# Altium project BaseCricuit.PrjPcb
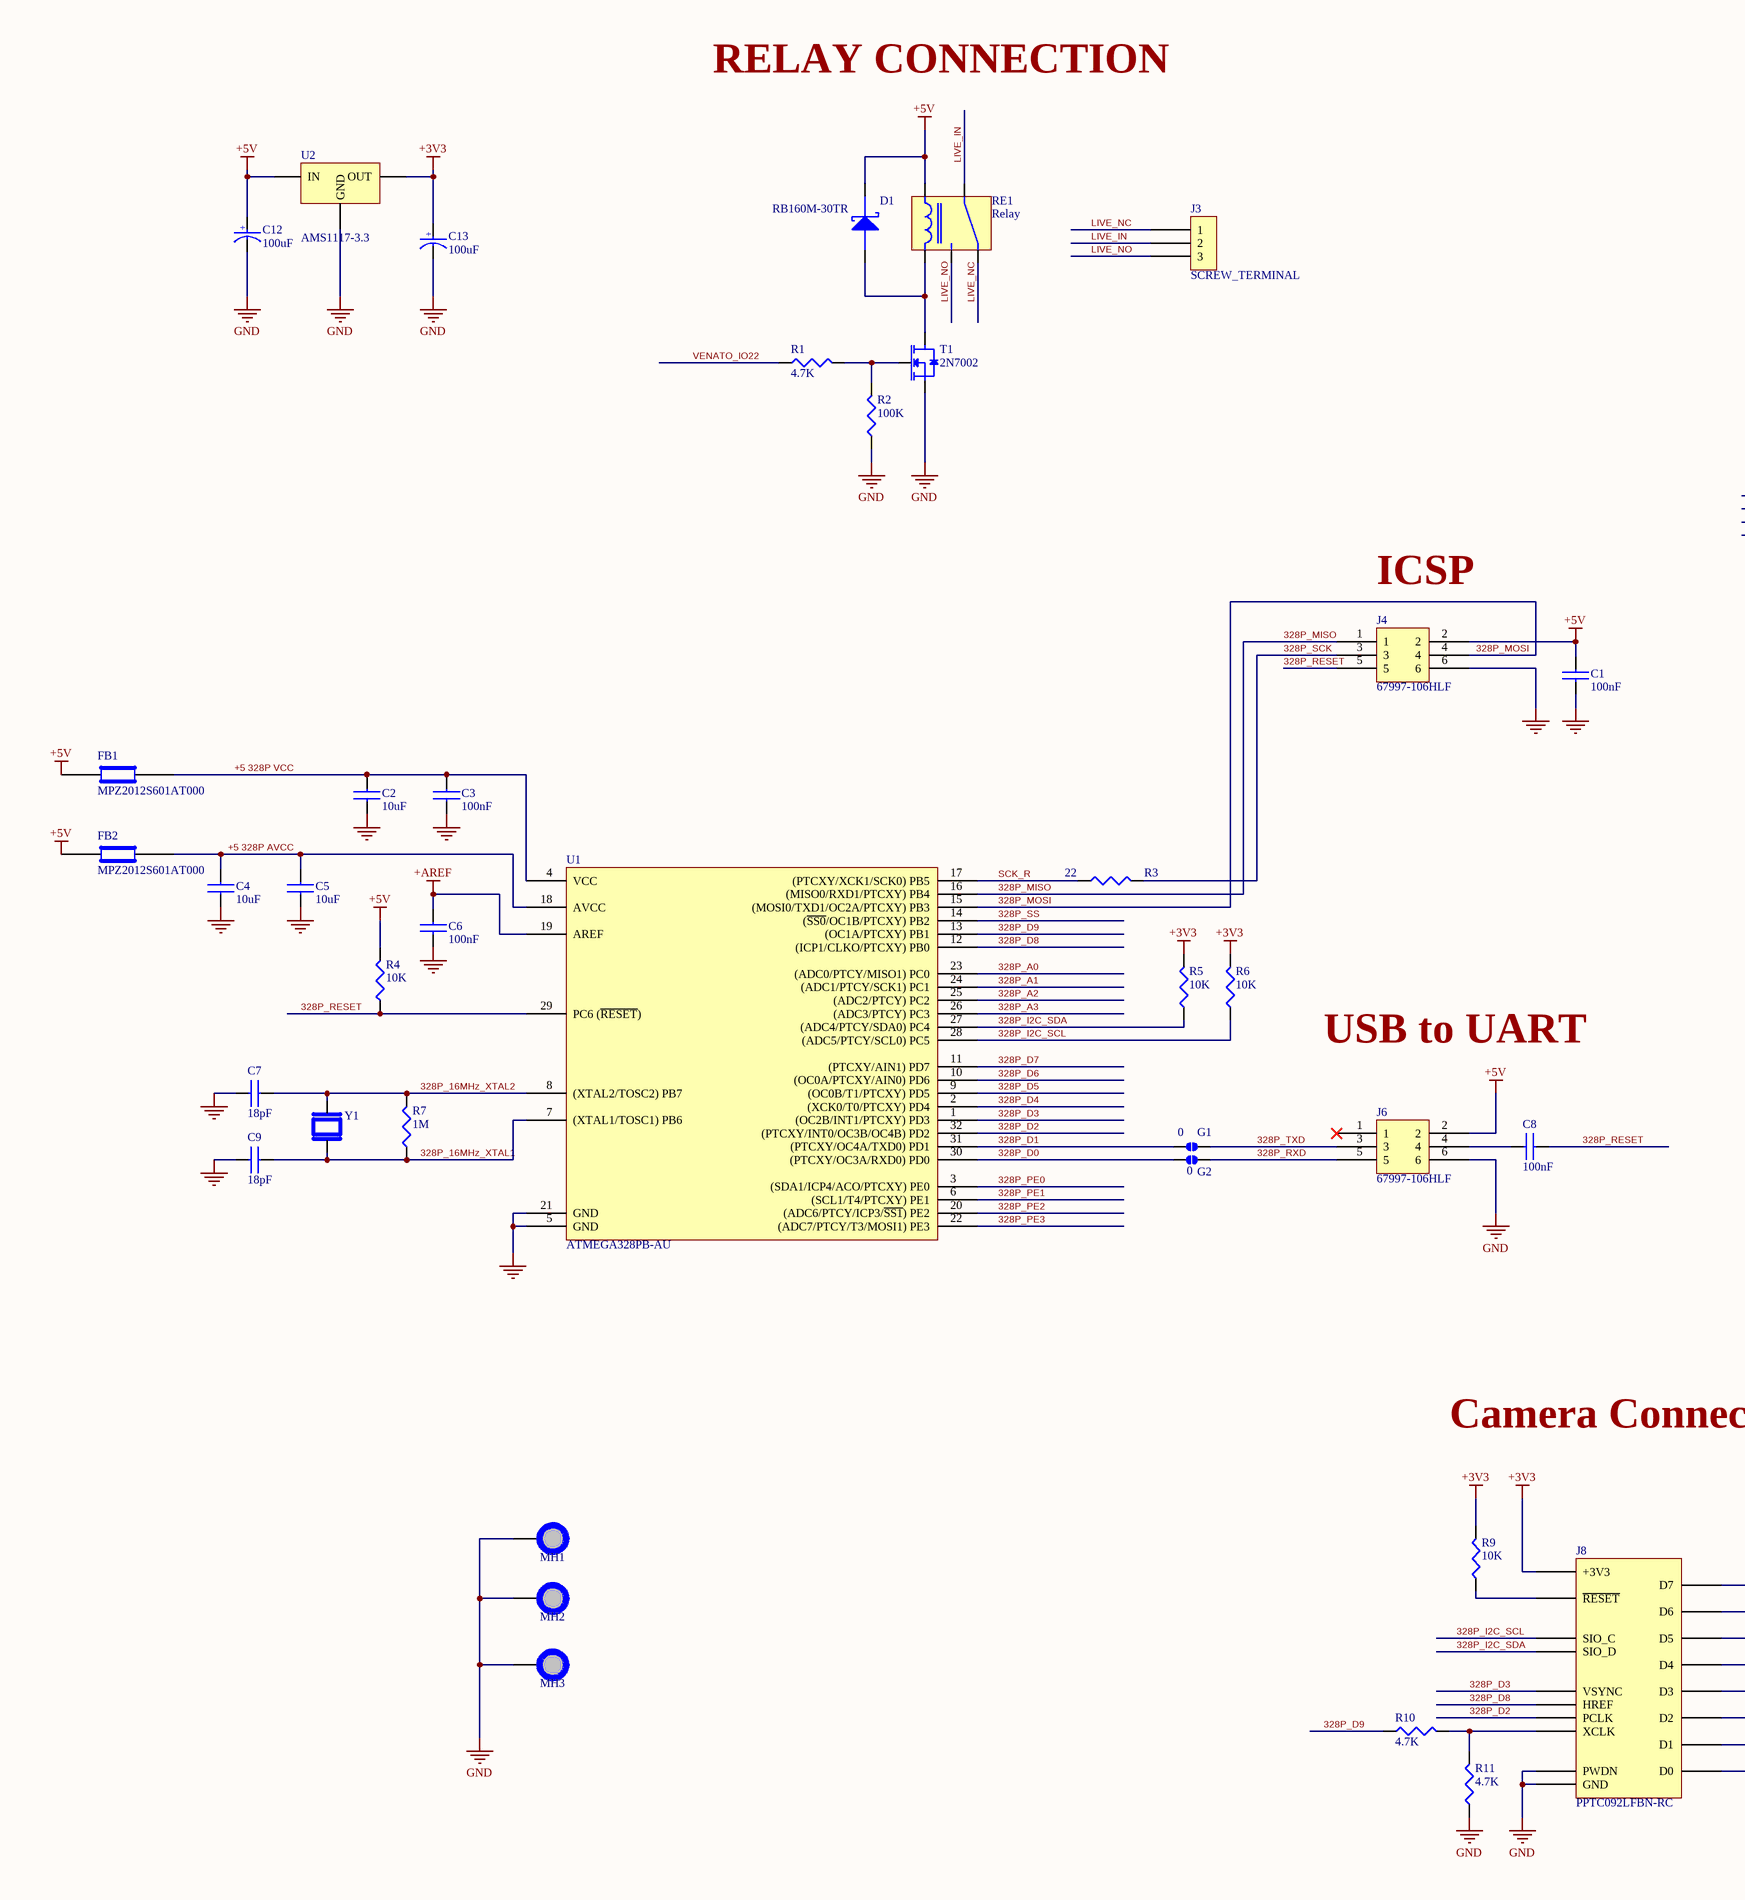
[diagram p0: BaseCircuit.SchDoc, left]
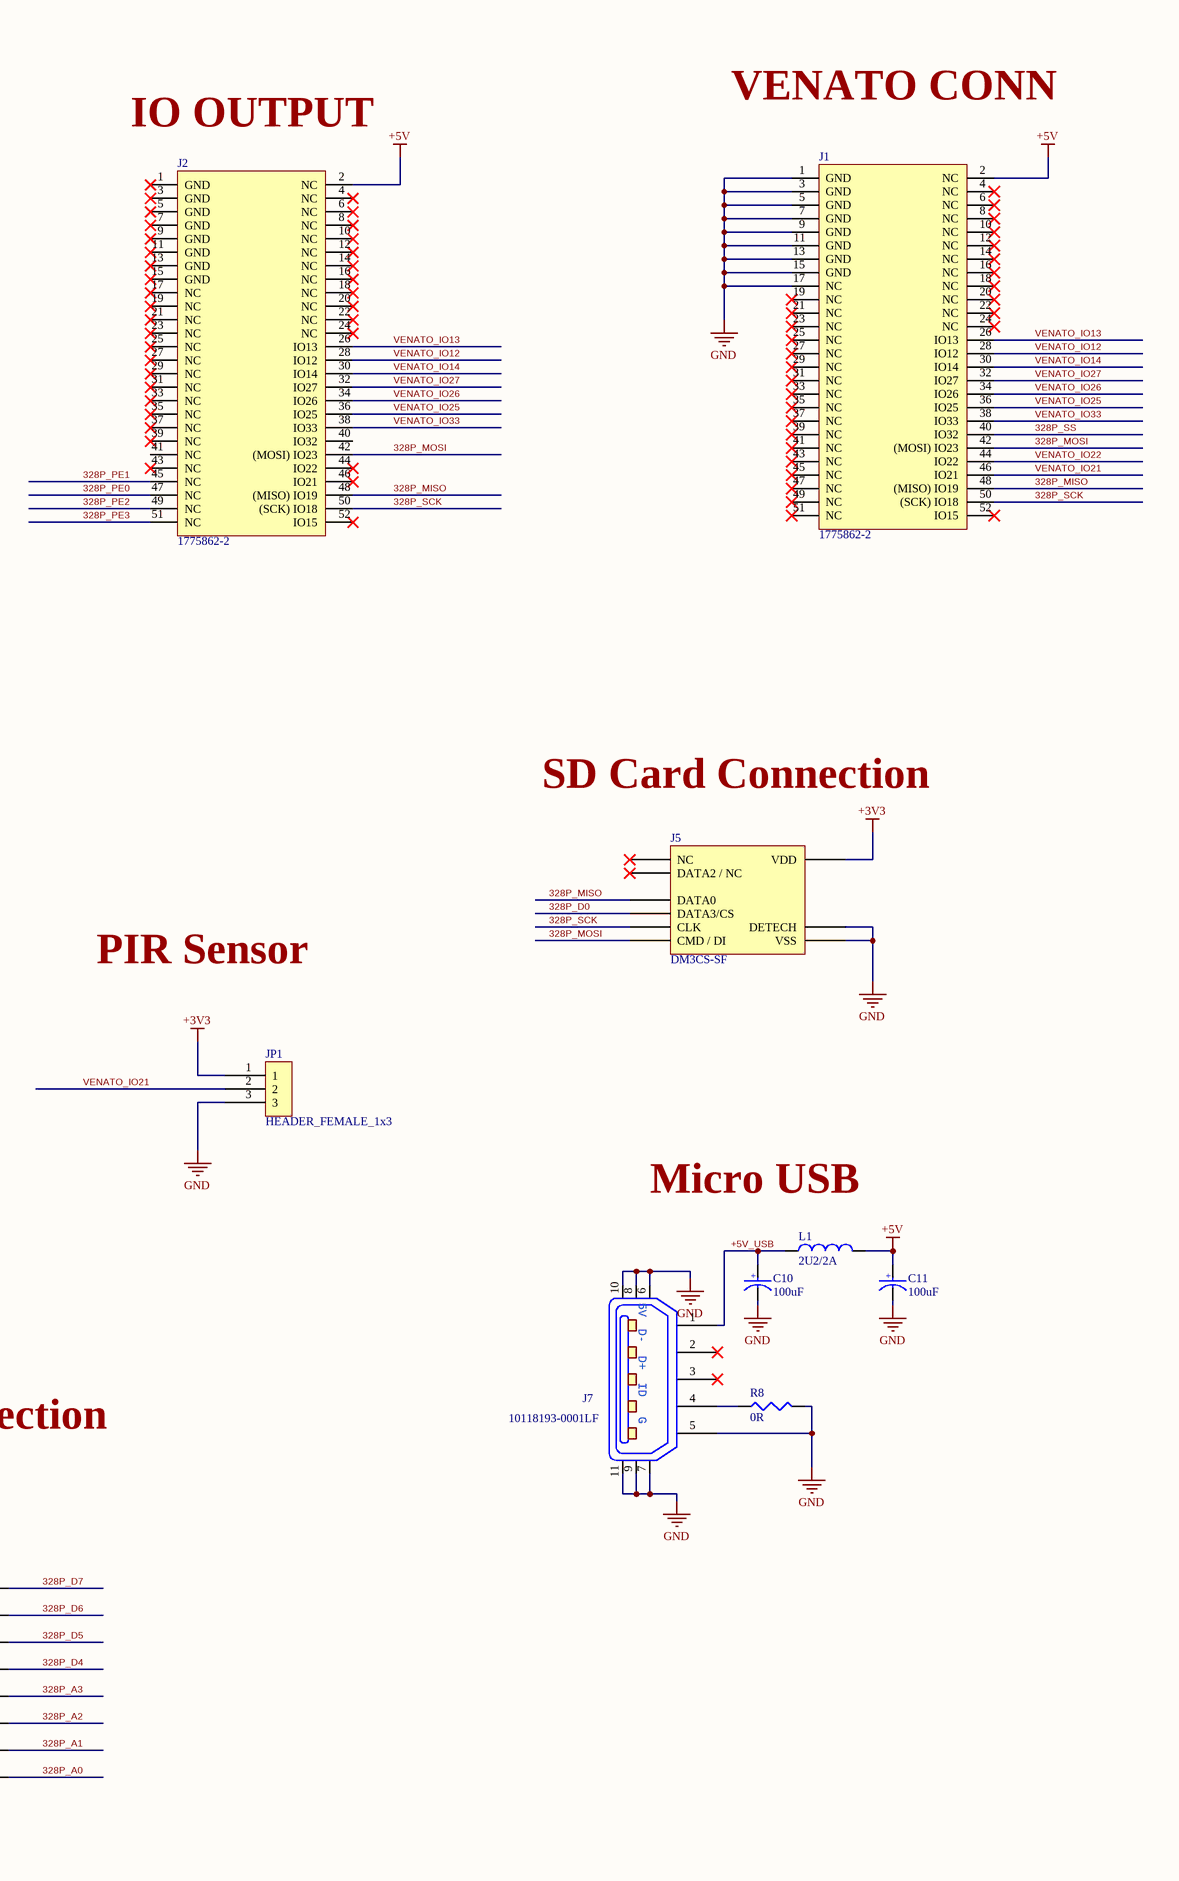
[diagram p1: BaseCircuit.SchDoc, right]
1 sheet, 47 parts. Net scope: global (net labels, ports and power ports of the same name join across sheets).
Board file: BaseCircuit.PcbDoc

## Sheet BaseCircuit.SchDoc
size 594 x 419 mm; SheetNumber: 1; SheetTotal: 1

### Parts
C1  100nF  [C0805]
C2  10uF  [C0805]
C3  100nF  [C0805]
C4  10uF  [C0805]
C5  10uF  [C0805]
C6  100nF  [C0805]
C7  18pF  [C0805]
C8  100nF  [C0805]
C9  18pF  [C0805]
C10  100uF  [C_ALU_C_SIZE]
C11  100uF  [C_ALU_C_SIZE]
C12  100uF  [C_ALU_C_SIZE]
C13  100uF  [C_ALU_C_SIZE]
D1  RB160M-30TR  [SOD123]
FB1  MPZ2012S601AT000  [C0805]
FB2  MPZ2012S601AT000  [C0805]
G1  0  [R0805_no_3d]
G2  0  [R0805_no_3d]
J1  1775862-2  [TE_1775862-2]
J2  1775862-2  [TE_1775862-2]
J3  SCREW_TERMINAL  [SCREW_TERMINAL_3_5.08MM]
J4  67997-106HLF  [HDR_2x3_2.54MM]
J5  DM3CS-SF  [GCT_MEM2051-00-195-00-A]
J6  67997-106HLF  [HDR_2x3_2.54MM]
J7  10118193-0001LF  [10118193-0001LF]
J8  PPTC092LFBN-RC  [HDR_2X9_2.54MM]
JP1  HEADER_FEMALE_1x3  [HDR_1x3_2.54MM]
L1  2U2/2A  [CL_inductor]
MH1  Mounting_hole_17.4_3.2  [MH_17.4_3.2]  (value not drawn)  (no BOM)
MH2  Mounting_hole_17.4_3.2  [MH_17.4_3.2]  (value not drawn)  (no BOM)
MH3  Mounting_hole_17.4_3.2  [MH_17.4_3.2]  (value not drawn)  (no BOM)
R1  4.7K  [R0805]
R2  100K  [R0805]
R3  22  [R0805]
R4  10K  [R0805]
R5  10K  [R0805]
R6  10K  [R0805]
R7  1M  [R0805]
R8  0R  [R0805]
R9  10K  [R0805]
R10  4.7K  [R0805]
R11  4.7K  [R0805]
RE1  Relay  [RELAY_5PIN]
T1  2N7002  [TRANS_MMBT2907A]
U1  ATMEGA328PB-AU  [TQFP_32]
U2  AMS1117-3.3  [SOT-223]
Y1  ABLS-16.000MHZ-B4-T  [XTAL_ABLS-16.000MHZ-B4-T]  (value not drawn)

### Nets
+3V3: C13.1 J5.4(VDD) J8.1(+3V3) JP1.1 R5.2 R6.2 R9.2 U2.2(OUT)
+5V: C1.2 C11.1 C12.1 D1.1(Ca) FB1.1 FB2.1 J1.2(NC) J2.2(NC) J4.2 J6.2 L1.2 R4.2 RE1.1 U2.3(IN)
+AREF: C6.2 U1.19(AREF)
GND: C1.1 C2.1 C3.1 C4.1 C5.1 C6.1 C7.1 C9.1 C10.2 C11.2 C12.2 C13.2 J1.1(GND) J1.3(GND) J1.5(GND) J1.7(GND) J1.9(GND) J1.11(GND) J1.13(GND) J1.15(GND) J1.17(NC) J4.6 J5.6(VSS) J5.9(DETECH) J6.6 J7.5 J7.6 J7.7 J7.8 J7.9 J7.10 J7.11 J8.2(GND) J8.18(PWDN) JP1.3 MH1.1 MH2.1 MH3.1 R2.1 R8.2 R11.1 T1.1 U1.5(GND) U1.21(GND) U2.1(GND)
328P_16MHz_XTAL1: C9.2 R7.1 U1.7((XTAL1/TOSC1)_PB6) Y1.1
328P_16MHz_XTAL2: C7.2 R7.2 U1.8((XTAL2/TOSC2)_PB7) Y1.2
328P_A0: J8.16(D0) U1.23((ADC0/PTCY/MISO1)_PC0)
328P_A1: J8.15(D1) U1.24((ADC1/PTCY/SCK1)_PC1)
328P_A2: J8.14(D2) U1.25((ADC2/PTCY)_PC2)
328P_A3: J8.13(D3) U1.26((ADC3/PTCY)_PC3)
328P_D0: G2.2 J5.2(DATA3/CS) U1.30((PTCXY/OC3A/RXD0)_PD0)
328P_D1: G1.2 U1.31((PTCXY/OC4A/TXD0)_PD1)
328P_D2: J8.7(PCLK) U1.32((PTCXY/INT0/OC3B/OC4B)_PD2)
328P_D3: J8.5(VSYNC) U1.1((OC2B/INT1/PTCXY)_PD3)
328P_D4: J8.12(D4) U1.2((XCK0/T0/PTCXY)_PD4)
328P_D5: J8.11(D5) U1.9((OC0B/T1/PTCXY)_PD5)
328P_D6: J8.10(D6) U1.10((OC0A/PTCXY/AIN0)_PD6)
328P_D7: J8.9(D7) U1.11((PTCXY/AIN1)_PD7)
328P_D8: J8.6(HREF) U1.12((ICP1/CLKO/PTCXY)_PB0)
328P_D9: R10.1 U1.13((OC1A/PTCXY)_PB1)
328P_I2C_SCL: J8.3(SIO_C) R6.1 U1.28((ADC5/PTCY/SCL0)_PC5)
328P_I2C_SDA: J8.4(SIO_D) R5.1 U1.27((ADC4/PTCY/SDA0)_PC4)
328P_MISO: J1.48((MISO)_IO19) J2.48((MISO)_IO19) J4.1 J5.7(DATA0) U1.16((MISO0/RXD1/PTCXY)_PB4)
328P_MOSI: J1.42((MOSI)_IO23) J2.42((MOSI)_IO23) J4.4 J5.3(CMD_/_DI) U1.15((MOSI0/TXD1/OC2A/PTCXY)_PB3)
328P_PE0: J2.47(NC) U1.3((SDA1/ICP4/ACO/PTCXY)_PE0)
328P_PE1: J2.45(NC) U1.6((SCL1/T4/PTCXY)_PE1)
328P_PE2: J2.49(NC) U1.20((ADC6/PTCY/ICP3/~{SS1})_PE2)
328P_PE3: J2.51(NC) U1.22((ADC7/PTCY/T3/MOSI1)_PE3)
328P_RESET: C8.1 J4.5 R4.1 U1.29(PC6_(~{RESET}))
328P_RXD: G2.1 J6.5
328P_SCK: J1.50((SCK)_IO18) J2.50((SCK)_IO18) J4.3 J5.5(CLK) R3.2
328P_SS: J1.40(IO32) U1.14((~{SS0}/OC1B/PTCXY)_PB2)
328P_TXD: G1.1 J6.3
+5 328P AVCC: C4.2 C5.2 FB2.2 U1.18(AVCC)
+5 328P VCC: C2.2 C3.2 FB1.2 U1.4(VCC)
+5V_USB: C10.1 J7.1 L1.1
LIVE_IN: J3.2 RE1.5
LIVE_NC: J3.1 RE1.3
LIVE_NO: J3.3 RE1.4
SCK_R: R3.1 U1.17((PTCXY/XCK1/SCK0)_PB5)
VENATO_IO12: J1.28(IO12) J2.28(IO12)
VENATO_IO13: J1.26(IO13) J2.26(IO13)
VENATO_IO14: J1.30(IO14) J2.30(IO14)
VENATO_IO21: J1.46(IO21) JP1.2
VENATO_IO22: J1.44(IO22) R1.1
VENATO_IO25: J1.36(IO25) J2.36(IO25)
VENATO_IO26: J1.34(IO26) J2.34(IO26)
VENATO_IO27: J1.32(IO27) J2.32(IO27)
VENATO_IO33: J1.38(IO33) J2.38(IO33)
NetC8_2: C8.2 J6.4
NetD1_2: D1.2(An) RE1.2 T1.2
NetJ7_4: J7.4 R8.1
NetJ8_8: J8.8(XCLK) R10.2 R11.2
NetJ8_17: J8.17(~{RESET}) R9.1
NetR1_2: R1.2 R2.2 T1.3

Not connected (* = marked no-connect by the designer): J1 4(NC)* 6(NC)* 8(NC)* 10(NC)* 12(NC)* 14(NC)* 16(NC)* 18(NC)* 19(NC)* 20(NC)* 21(NC)* 22(NC)* 23(NC)* 24(NC)* 25(NC)* 27(NC)* 29(NC)* 31(NC)* 33(NC)* 35(NC)* 37(NC)* 39(NC)* 41(NC)* 43(NC)* 45(NC)* 47(NC)* 49(NC)* 51(NC)* 52(IO15)*; J2 1(GND)* 3(GND)* 4(NC)* 5(GND)* 6(NC)* 7(GND)* 8(NC)* 9(GND)* 10(NC)* 11(GND)* 12(NC)* 13(GND)* 14(NC)* 15(GND)* 16(NC)* 17(NC)* 18(NC)* 19(NC)* 20(NC)* 21(NC)* 22(NC)* 23(NC)* 24(NC)* 25(NC)* 27(NC)* 29(NC)* 31(NC)* 33(NC)* 35(NC)* 37(NC)* 39(NC)* 40(IO32) 41(NC) 43(NC)* 44(IO22)* 46(IO21)* 52(IO15)*; J5 1(DATA2_/_NC)* 8(NC)*; J6 1*; J7 2* 3*

### Notes on the sheet
- RELAY CONNECTION
- VENATO CONN
- (near J2) IO OUTPUT
- (near J4) ICSP
- SD Card Connection
- PIR Sensor
- USB to UART
- Micro USB
- Camera Connection
- (in symbol 10118193-0001LF) 5V; D-; D+; ID; G
- (in symbol EEE-1AA101WR) +

### Library data of the parts
C1 C3 C6 C8 = CGA4J2X7R1H104K125AM: Cap Ceramic 0.1uF 50V X7R 10% Pad SMD 0805 125°C Automotive T/R; Manufacturer: TDK; Supplier 1: Digi-Key; Manufacturer Part Number: CGA4J2X7R1H104K125AM; RoHS: Yes; Category: Ceramic Capacitors; Stock 1: 4940; Pricing 1: 1=0.20000, 10=0.14200, 50=0.08080, 100=0.06700, 500=0.04696, 1000=0.03888 (USD); Mount: Surface Mount; Case/Package: 0805; Case Code (Metric): 2012; Case Code (Imperial): 0805; Weight: 0.000194oz; Min Operating Temperature: -55°C; Max Operating Temperature: 125°C; Capacitance: 100nF; Voltage Rating: 50V; Tolerance: 10%; Packaging: Tape and Reel; Termination: SMD/SMT; Series: CGA; Package Quantity: 1; Voltage Rating (DC): 50V; Dielectric: X7R; Resistor Type: Ceramic; Features: Soft Termination; Length: 0.079inch; Width: 0.049inch; Height: 1.25mm; Thickness: 0.057inch; Depth: 1.25mm; Ratings: AEC-Q200; RoHS Compliant: Yes; ComponentLink1URL: http://components.arrow.com/part/dataview/0323_06888403?src-supplier=Arrow+Europe; ComponentLink1Description: http://components.arrow.com/part/dataview/0323_06888403?src-supplier=Arrow+Europe; ComponentLink2URL: https://product.tdk.com/info/en/catalog/datasheets/mlcc_automotive_openmode_en.pdf?src-supplier=Digi-Key; ComponentLink2Description: https://product.tdk.com/info/en/catalog/datasheets/mlcc_automotive_openmode_en.pdf?src-supplier=Digi-Key; ComponentLink3URL: https://product.tdk.com/info/en/documents/chara_sheet/CGA4J2X7R1H104K125AM.pdf?src-supplier=Digi-Key; ComponentLink3Description: https://product.tdk.com/info/en/documents/chara_sheet/CGA4J2X7R1H104K125AM.pdf?src-supplier=Digi-Key; ComponentLink4URL: http://components.arrow.com/part/dataview/57437351S460182N1165?src-supplier=Arrow+Electronics; ComponentLink4Description: http://components.arrow.com/part/dataview/57437351S460182N1165?src-supplier=Arrow+Electronics; Supplier Part Number 1: 445-6958-1-ND
C2 C4 C5 = CGA4J3X7S1A106M125AB: Cap Ceramic 10uF 10V X7S 20% Pad SMD 0805 125°C Low ESR Automotive T/R; Manufacturer: TDK; Supplier 1: Digi-Key; Manufacturer Part Number: CGA4J3X7S1A106M125AB; RoHS: Yes; Category: Ceramic Capacitors; Stock 1: 10; Pricing 1: 1=0.45000, 10=0.31600, 50=0.23880, 100=0.20790, 500=0.15400, 1000=0.13090 (USD); Mount: Surface Mount; Case/Package: 0805; Case Code (Metric): 2012; Case Code (Imperial): 0805; Weight: 0.000194oz; Min Operating Temperature: -55°C; Max Operating Temperature: 125°C; Packaging: Tape and Reel; Capacitance: 10uF; Voltage Rating: 10V; Tolerance: 20%; Dielectric: X7S; Termination: SMD/SMT; Voltage Rating (DC): 10V; Package Quantity: 2000; Length: 0.079inch; Width: 1.25mm; Height: 1.25mm; Thickness: 0.057inch; Ratings: AEC-Q200; RoHS Compliant: Yes; ComponentLink1URL: http://www.mouser.com/ds/2/400/lcc_automotive_general_en-843974.pdf?src-supplier=Mouser; ComponentLink1Description: http://www.mouser.com/ds/2/400/lcc_automotive_general_en-843974.pdf?src-supplier=Mouser; ComponentLink2URL: https://product.tdk.com/info/en/documents/chara_sheet/CGA4J3X7S1A106M125AB.pdf?src-supplier=Digi-Key; ComponentLink2Description: https://product.tdk.com/info/en/documents/chara_sheet/CGA4J3X7S1A106M125AB.pdf?src-supplier=Digi-Key; Supplier Part Number 1: 445-16115-1-ND
C7 C9 = C0805C180J5GACTU: Cap Ceramic 18pF 50V C0G 5% SMD 0805 125C Paper T/R; Manufacturer: KEMET; Temperature Coefficient: 30ppm/°C; Dissipation Factor: 0.1%; Supplier 1: Digi-Key; Manufacturer Part Number: C0805C180J5GACTU; RoHS: Yes; Category: Ceramic Capacitors; Stock 1: 100835; Pricing 1: 1=0.12000, 10=0.08600, 50=0.04900, 100=0.04070, 500=0.02852, 1000=0.02361 (USD); Mount: Surface Mount,PCB; Case/Package: 0805; Number of Pins: 2; Dielectric Material: Ceramic; Case Code (Imperial): 0805; Case Code (Metric): 2012; Contact Plating: Tin,Matte; Contact Material: Tin; Min Operating Temperature: -55°C; Max Operating Temperature: 125°C; Tolerance: 5%; Capacitance: 18pF; Dielectric: C0G; Packaging: Tape and Reel; Termination: SMD/SMT; Voltage Rating (DC): 50V; Package Quantity: 1; Series: C; Construction: Flat; Voltage: 50V; Voltage Rating: 50V; Length: 2mm; Width: 1.2mm; Height: 0.78mm; Depth: 1.25mm; Lead Pitch: 0.75mm; Thickness: 0.035inch; Radiation Hardening: No; Lead Free: Lead Free; RoHS Compliant: Yes; REACH SVHC: No SVHC; ComponentLink1URL: https://datasheet.ciiva.com/22746/1769375-22746770.pdf?src-supplier=Element14; ComponentLink1Description: https://datasheet.ciiva.com/22746/1769375-22746770.pdf?src-supplier=Element14; ComponentLink2URL: https://datasheet.ciiva.com/26923/getdatasheetpartid-759702-26923980.pdf?src-supplier=Verical; ComponentLink2Description: https://datasheet.ciiva.com/26923/getdatasheetpartid-759702-26923980.pdf?src-supplier=Verical; ComponentLink3URL: https://datasheet.ciiva.com/26847/getdatasheetpartid-385668-26847862.pdf?src-supplier=Verical; ComponentLink3Description: https://datasheet.ciiva.com/26847/getdatasheetpartid-385668-26847862.pdf?src-supplier=Verical; Supplier Part Number 1: 399-C0805C180J5GAC7800CT-ND
C10-C13 = EEE-1AA101WR: Cap Aluminum 100uF 10V 20% (5 X 5.4mm) SMD 50mA 1000 hr 85°C T/R; Manufacturer: Panasonic; Life (Hours): 1000Hour; Supplier 1: RSComponents; Manufacturer Part Number: EEE-1AA101WR; RoHS: Yes; Category: Aluminum Electrolytic Capacitors; Stock 1: 1; Pricing 1: 1000=0.07800, 3000=0.07400 (USD); Mount: Surface Mount,PCB; Case/Package: Radial; Contact Plating: Tin; Min Operating Temperature: -40°C; Max Operating Temperature: 85°C; Capacitance: 100uF; Tolerance: 20%; Ripple Current: 50mA; Voltage Rating: 10V; Packaging: Tape and Reel; Package Quantity: 1; Voltage Rating (DC): 10V; Termination: SMD/SMT; Ripple Current (AC): 50mA; Series: S; Construction: Cylindrical; Diameter: 5mm; Length: 5.5mm; Height: 5.4mm; Height - Seated (Max): 0.213inch; Radiation Hardening: No; Lead Free: Lead Free; RoHS Compliant: Yes; REACH SVHC: Unknown; ComponentLink1URL: https://datasheet.ciiva.com/26945/getdatasheetpartid-169213-26945071.pdf?src-supplier=Verical; ComponentLink1Description: https://datasheet.ciiva.com/26945/getdatasheetpartid-169213-26945071.pdf?src-supplier=Verical; ComponentLink2URL: https://datasheet.ciiva.com/24027/aba0000ce2-40801-24027541.pdf?src-supplier=Mouser; ComponentLink2Description: https://datasheet.ciiva.com/24027/aba0000ce2-40801-24027541.pdf?src-supplier=Mouser; ComponentLink3URL: https://datasheet.ciiva.com/14598/70255710-14598233.pdf?src-supplier=Allied+Electronics; ComponentLink3Description: https://datasheet.ciiva.com/14598/70255710-14598233.pdf?src-supplier=Allied+Electronics; ComponentLink4URL: https://datasheet.ciiva.com/14605/70255710-14605689.pdf?src-supplier=Allied+Electronics; ComponentLink4Description: https://datasheet.ciiva.com/14605/70255710-14605689.pdf?src-supplier=Allied+Electronics; ComponentLink5URL: https://datasheet.ciiva.com/11673/aba0000ce2-11673882.pdf?src-supplier=Avnet; ComponentLink5Description: https://datasheet.ciiva.com/11673/aba0000ce2-11673882.pdf?src-supplier=Avnet; ComponentLink6URL: https://datasheet.ciiva.com/16427/aba0000ce2-16427544.pdf?src-supplier=Future+Electronics; ComponentLink6Description: https://datasheet.ciiva.com/16427/aba0000ce2-16427544.pdf?src-supplier=Future+Electronics; ComponentLink7URL: https://datasheet.ciiva.com/2983/aba0000ce2-2983906.pdf?src-supplier=Avnet; ComponentLink7Description: https://datasheet.ciiva.com/2983/aba0000ce2-2983906.pdf?src-supplier=Avnet; ComponentLink8URL: https://datasheet.ciiva.com/30075/11aba0000ce2-30075303.pdf?src-supplier=Onlinecomponents.com; ComponentLink8Description: https://datasheet.ciiva.com/30075/11aba0000ce2-30075303.pdf?src-supplier=Onlinecomponents.com; Supplier Part Number 1: 1763738
D1 = RB160M-30TR: DIODE SCHOTTKY 30V 1A PMDU; Manufacturer: Rohm; Max Surge Current: 30A; Max Reverse Leakage Current: 50uA; Forward Voltage: 430mV; Element Configuration: Single; Polarity: Standard; Manufacturer Part Number: RB160M-30TR; RoHS: Yes; Category: Rectifier Diodes; Stock 1: 1870; Pricing 1: 1=0.39000 (USD); Mount: Surface Mount; Number of Pins: 2; Min Operating Temperature: -40°C; Max Operating Temperature: 125°C; Package Quantity: 1; Packaging: Tape and Reel; Average Rectified Current: 1A; Max Reverse Voltage (DC): 30V; Forward Current: 1A; Max Reverse Current: 50uA; Max Repetitive Reverse Voltage (Vrrm): 30V; Max Forward Surge Current (Ifsm): 30A; Peak Non-Repetitive Surge Current: 30A; Termination: SMD/SMT; Series: -; Voltage Rating (DC): 30V; Current Rating: 1A; Output Current: 1A; Radiation Hardening: No; RoHS Compliant: Yes; Reach SVHC Compliant: Yes; Lead Free: Lead Free; ComponentLink1URL: https://datasheet.ciiva.com/22696/24622-22696102.pdf?src-supplier=Element14; ComponentLink1Description: https://datasheet.ciiva.com/22696/24622-22696102.pdf?src-supplier=Element14; ComponentLink2URL: https://datasheet.ciiva.com/13083/rb160m-30-210354-13083762.pdf?src-supplier=Mouser; ComponentLink2Description: https://datasheet.ciiva.com/13083/rb160m-30-210354-13083762.pdf?src-supplier=Mouser; ComponentLink3URL: https://datasheet.ciiva.com/913/rb160m-30-913552.pdf?src-supplier=Digi-Key; ComponentLink3Description: https://datasheet.ciiva.com/913/rb160m-30-913552.pdf?src-supplier=Digi-Key; ComponentLink4URL: https://datasheet.ciiva.com/16208/rb160m-30-16208896.pdf?src-supplier=Future+Electronics; ComponentLink4Description: https://datasheet.ciiva.com/16208/rb160m-30-16208896.pdf?src-supplier=Future+Electronics; ComponentLink5URL: https://datasheet.ciiva.com/7624/24622-7624621.pdf?src-supplier=Element14; ComponentLink5Description: https://datasheet.ciiva.com/7624/24622-7624621.pdf?src-supplier=Element14; ComponentLink6URL: https://datasheet.ciiva.com/3021/rb160m-30-3021996.pdf?src-supplier=Avnet; ComponentLink6Description: https://datasheet.ciiva.com/3021/rb160m-30-3021996.pdf?src-supplier=Avnet
FB1 FB2 = MPZ2012S601AT000: Ferrite Beads Multi-Layer Power 600Ohm 25% 100MHz 2A 100mOhm DCR 0805 T/R; Manufacturer: TDK; Impedance: 600R; DC Resistance (DCR): 100mR; Supplier 1: Digi-Key; Manufacturer Part Number: MPZ2012S601AT000; RoHS: Yes; Category: Ferrite Beads and Chips; Pricing 1: 1=0.12000, 10=0.10100, 25=0.09040, 50=0.06640, 100=0.05740, 250=0.04528, 500=0.03824, 1000=0.03221 (USD); Mount: Surface Mount; Case/Package: 0805; Case Code (Metric): 2012; Case Code (Imperial): 0805; Packaging: Tape and Reel; Package Quantity: 1; Current Rating: 2A; Max DC Current: 2A; Series: MPZ; Length: 0.079inch; Width: 0.049inch; Height: 0.041inch; REACH SVHC: No SVHC; Lead Free: Lead Free; RoHS Compliant: Yes; ComponentLink1URL: https://datasheet.ciiva.com/46634/beads-commercial-power-mpz-en-46634377.pdf?src-supplier=Digi-Key; ComponentLink1Description: https://datasheet.ciiva.com/46634/beads-commercial-power-mpz-en-46634377.pdf?src-supplier=Digi-Key; ComponentLink2URL: https://datasheet.ciiva.com/46634/beads-commercial-power-mpz-en-46634606.pdf?src-supplier=Digi-Key; ComponentLink2Description: https://datasheet.ciiva.com/46634/beads-commercial-power-mpz-en-46634606.pdf?src-supplier=Digi-Key; ComponentLink3URL: https://datasheet.ciiva.com/46634/beads-commercial-power-mpz-en-46634335.pdf?src-supplier=Digi-Key; ComponentLink3Description: https://datasheet.ciiva.com/46634/beads-commercial-power-mpz-en-46634335.pdf?src-supplier=Digi-Key; Supplier Part Number 1: 445-2206-6-ND
G1 G2 = 0Ohm gap: This is a gap that diconects line. you can connect it using soldier
J1 J2 = 1775862-2: MSATA/MINI PCI-E 5.2H TYPE I G/F; Manufacturer: TE Connectivity; Supplier 1: RSComponents; Manufacturer Part Number: 1775862-2; RoHS: Yes; Category: Card Edge Connectors; Stock 1: 6580; Pricing 1: 50=0.50600, 100=0.45800, 250=0.41400 (GBP); ComponentLink1URL: http://components.arrow.com/part/dataview/47764795S8999339N5665?src-supplier=Arrow+Electronics; ComponentLink1Description: http://components.arrow.com/part/dataview/47764795S8999339N5665?src-supplier=Arrow+Electronics; ComponentLink2URL: http://www.farnell.com/datasheets/2645681.pdf?src-supplier=Farnell; ComponentLink2Description: http://www.farnell.com/datasheets/2645681.pdf?src-supplier=Farnell; ComponentLink3URL: http://www.onlinecomponents.com/datasheet/17758622.aspx?p=10266609&src-supplier=Onlinecomponents.com; ComponentLink3Description: http://www.onlinecomponents.com/datasheet/17758622.aspx?p=10266609&src-supplier=Onlinecomponents.com; ComponentLink4URL: https://www.te.com/commerce/DocumentDelivery/DDEController?Action=srchrtrv&amp;DocNm=8-1773459-7_EXPRESS_MINI_CARD_QRG&amp;DocType=DS&amp;DocLang=English&src-supplier=Digi-Key; ComponentLink4Description: https://www.te.com/commerce/DocumentDelivery/DDEController?Action=srchrtrv&amp;DocNm=8-1773459-7_EXPRESS_MINI_CARD_QRG&amp;DocType=DS&amp;DocLang=English&src-supplier=Digi-Key; ComponentLink5URL: https://www.te.com/commerce/DocumentDelivery/DDEController?Action=srchrtrv&DocNm=1775862&DocType=Customer+Drawing&DocLang=English&src-supplier=Digi-Key; ComponentLink5Description: https://www.te.com/commerce/DocumentDelivery/DDEController?Action=srchrtrv&DocNm=1775862&DocType=Customer+Drawing&DocLang=English&src-supplier=Digi-Key; ComponentLink6URL: http://www.te.com/commerce/DocumentDelivery/DDEController?Action=showdoc&DocId=Data+Sheet8-1773459-7_EXPRESS_MINI_CARD_QRG1011pdfEnglishENG_DS_8-1773459-7_EXPRESS_MINI_CARD_QRG_1011.pdf&src-supplier=Avnet; ComponentLink6Description: http://www.te.com/commerce/DocumentDelivery/DDEController?Action=showdoc&DocId=Data+Sheet8-1773459-7_EXPRESS_MINI_CARD_QRG1011pdfEnglishENG_DS_8-1773459-7_EXPRESS_MINI_CARD_QRG_1011.pdf&src-supplier=Avnet; ComponentLink7URL: http://www.farnell.com/datasheets/2645681.pdf?src-supplier=Newark; ComponentLink7Description: http://www.farnell.com/datasheets/2645681.pdf?src-supplier=Newark; ComponentLink8URL: http://www.farnell.com/datasheets/2645681.pdf?src-supplier=Element14; ComponentLink8Description: http://www.farnell.com/datasheets/2645681.pdf?src-supplier=Element14; Supplier Part Number 1: 2411326P
J4 J6 = 67997-106HLF: Conn Unshrouded Header HDR 6 POS 2.54mm Solder ST Top Entry Thru-Hole BergStik® Bulk; Manufacturer: ICC; Supplier 1: Newark; Manufacturer Part Number: 67997-106HLF; RoHS: No; Category: Headers and Wire Housings; Stock 1: 9; Pricing 1: 1=2.27000, 10=1.89000, 25=1.86000, 50=1.84000, 100=1.82000, 200=0.69900, 250=1.65000, 500=1.53000, 1000=1.33000, 2000=0.69900, 5000=0.69900 (USD); ComponentLink1URL: http://www.farnell.com/datasheets/1876884.pdf?src-supplier=Newark; ComponentLink1Description: http://www.farnell.com/datasheets/1876884.pdf?src-supplier=Newark; Supplier Part Number 1: 06M1758
J5 = DM3CS-SF: Connector, Memory, Micro Sd, Hinged Rohs Compliant: Yes; Manufacturer: Hirose; Supplier 1: RSComponents; Manufacturer Part Number: DM3CS-SF; RoHS: Yes; Category: Memory Connectors; Stock 1: 50; Pricing 1: 5=1.36800, 125=1.23200, 375=0.98800, 1000=0.68800, 2000=0.50800 (GBP); ComponentLink1URL: https://datasheet.ciiva.com/683/e60900232-683360.pdf?src-supplier=Digi-Key; ComponentLink1Description: https://datasheet.ciiva.com/683/e60900232-683360.pdf?src-supplier=Digi-Key; ComponentLink2URL: https://datasheet.ciiva.com/16434/e60900232-16434058.pdf?src-supplier=Future+Electronics; ComponentLink2Description: https://datasheet.ciiva.com/16434/e60900232-16434058.pdf?src-supplier=Future+Electronics; ComponentLink3URL: https://datasheet.ciiva.com/4581/e60900232-38395-4581034.pdf?src-supplier=Mouser; ComponentLink3Description: https://datasheet.ciiva.com/4581/e60900232-38395-4581034.pdf?src-supplier=Mouser; ComponentLink4URL: https://datasheet.ciiva.com/7651/1465328-7651895.pdf?src-supplier=Element14; ComponentLink4Description: https://datasheet.ciiva.com/7651/1465328-7651895.pdf?src-supplier=Element14; ComponentLink5URL: https://datasheet.ciiva.com/3122/e60900232-3122536.pdf?src-supplier=Avnet; ComponentLink5Description: https://datasheet.ciiva.com/3122/e60900232-3122536.pdf?src-supplier=Avnet; ComponentLink6URL: https://datasheet.ciiva.com/683/e60900232-683359.pdf?src-supplier=Digi-Key; ComponentLink6Description: https://datasheet.ciiva.com/683/e60900232-683359.pdf?src-supplier=Digi-Key; ComponentLink7URL: https://datasheet.ciiva.com/683/e60900232-683361.pdf?src-supplier=Digi-Key; ComponentLink7Description: https://datasheet.ciiva.com/683/e60900232-683361.pdf?src-supplier=Digi-Key; Supplier Part Number 1: 7726787
J7 = 10118193-0001LF: FCI Right Angle Surface Mount Mount Female USB Connector; 100 V ac; 1.8A; Manufacturer: Amphenol ICC / FCI; Supplier 1: Digi-Key; Manufacturer Part Number: 10118193-0001LF; RoHS: No; Category: USB Connectors; Stock 1: 101220; Pricing 1: 1=0.48000, 10=0.42000, 25=0.38440, 50=0.36160, 100=0.34660, 250=0.31640, 500=0.30136 (USD); ComponentLink1URL: http://components.arrow.com/part/dataview/0323_04107372?src-supplier=Arrow+Europe; ComponentLink1Description: http://components.arrow.com/part/dataview/0323_04107372?src-supplier=Arrow+Europe; ComponentLink2URL: http://uk.rs-online.com/webdocs/1450/0900766b814507f1.pdf?src-supplier=RSComponents; ComponentLink2Description: http://uk.rs-online.com/webdocs/1450/0900766b814507f1.pdf?src-supplier=RSComponents; ComponentLink3URL: https://cdn.amphenol-icc.com/media/wysiwyg/files/documentation/datasheet/inputoutput/io_usb_micro.pdf?src-supplier=Avnet; ComponentLink3Description: https://cdn.amphenol-icc.com/media/wysiwyg/files/documentation/datasheet/inputoutput/io_usb_micro.pdf?src-supplier=Avnet; ComponentLink4URL: https://cdn.amphenol-icc.com/media/wysiwyg/files/documentation/datasheet/inputoutput/io_usb_micro.pdf?src-supplier=Arrow+Electronics; ComponentLink4Description: https://cdn.amphenol-icc.com/media/wysiwyg/files/documentation/datasheet/inputoutput/io_usb_micro.pdf?src-supplier=Arrow+Electronics; ComponentLink5URL: https://cdn.amphenol-icc.com/media/wysiwyg/files/documentation/datasheet/inputoutput/io_usb_micro.pdf?src-supplier=Onlinecomponents.com; ComponentLink5Description: https://cdn.amphenol-icc.com/media/wysiwyg/files/documentation/datasheet/inputoutput/io_usb_micro.pdf?src-supplier=Onlinecomponents.com; ComponentLink6URL: https://cdn.amphenol-icc.com/media/wysiwyg/files/documentation/datasheet/inputoutput/io_usb_micro.pdf?src-supplier=Verical; ComponentLink6Description: https://cdn.amphenol-icc.com/media/wysiwyg/files/documentation/datasheet/inputoutput/io_usb_micro.pdf?src-supplier=Verical; ComponentLink7URL: http://www.amphenol-icc.com/media/wysiwyg/files/drawing/10118193.pdf?src-supplier=Digi-Key; ComponentLink7Description: http://www.amphenol-icc.com/media/wysiwyg/files/drawing/10118193.pdf?src-supplier=Digi-Key; ComponentLink8URL: https://cdn.amphenol-icc.com/media/wysiwyg/files/documentation/datasheet/inputoutput/io_usb_micro.pdf?src-supplier=Digi-Key; ComponentLink8Description: https://cdn.amphenol-icc.com/media/wysiwyg/files/documentation/datasheet/inputoutput/io_usb_micro.pdf?src-supplier=Digi-Key; ComponentLink9URL: https://cdn.amphenol-icc.com/media/wysiwyg/files/documentation/datasheet/inputoutput/io_usb_micro.pdf?src-supplier=Mouser; ComponentLink9Description: https://cdn.amphenol-icc.com/media/wysiwyg/files/documentation/datasheet/inputoutput/io_usb_micro.pdf?src-supplier=Mouser; ComponentLink10URL: https://cdn.amphenol-icc.com/media/wysiwyg/files/documentation/datasheet/inputoutput/io_usb_micro.pdf?src-supplier=Allied+Electronics; ComponentLink10Description: https://cdn.amphenol-icc.com/media/wysiwyg/files/documentation/datasheet/inputoutput/io_usb_micro.pdf?src-supplier=Allied+Electronics; ComponentLink11URL: https://cdn.amphenol-icc.com/media/wysiwyg/files/documentation/datasheet/inputoutput/io_usb_micro.pdf?src-supplier=RSComponents; ComponentLink11Description: https://cdn.amphenol-icc.com/media/wysiwyg/files/documentation/datasheet/inputoutput/io_usb_micro.pdf?src-supplier=RSComponents; ComponentLink12URL: https://cdn.amphenol-icc.com/media/wysiwyg/files/documentation/datasheet/inputoutput/io_usb_micro.pdf?src-supplier=TTI; ComponentLink12Description: https://cdn.amphenol-icc.com/media/wysiwyg/files/documentation/datasheet/inputoutput/io_usb_micro.pdf?src-supplier=TTI; ComponentLink13URL: https://cdn.amphenol-icc.com/media/wysiwyg/files/documentation/datasheet/inputoutput/io_usb_micro.pdf?src-supplier=TME; ComponentLink13Description: https://cdn.amphenol-icc.com/media/wysiwyg/files/documentation/datasheet/inputoutput/io_usb_micro.pdf?src-supplier=TME; ComponentLink14URL: https://cdn.amphenol-icc.com/media/wysiwyg/files/documentation/datasheet/inputoutput/io_usb_micro.pdf?src-supplier=Heilind+Electronics; ComponentLink14Description: https://cdn.amphenol-icc.com/media/wysiwyg/files/documentation/datasheet/inputoutput/io_usb_micro.pdf?src-supplier=Heilind+Electronics; Supplier Part Number 1: 609-4616-1-ND
J8 = PPTC092LFBN-RC: Connector Header 18 Position 0.100" (2.54mm) Tin Through Hole; Manufacturer: Sullins; Manufacturer Part Number: PPTC092LFBN-RC; RoHS: Yes; Category: Connectors; Stock 1: 15534; Pricing 1: 1=1.09000, 10=0.91900, 80=0.82563, 440=0.67555, 1000=0.60048, 5000=0.54210 (USD); ComponentLink1URL: https://media.digikey.com/pdf/Data%20Sheets/Sullins%20PDFs/Female_Headers.100_DS.pdf?src-supplier=Digi-Key; ComponentLink1Description: https://media.digikey.com/pdf/Data%20Sheets/Sullins%20PDFs/Female_Headers.100_DS.pdf?src-supplier=Digi-Key; Supplier 1: Digi-Key; Supplier Part Number 1: S7077-ND
JP1 = 68000-103HLF: Conn Unshrouded Header HDR 3 POS 2.54mm Solder ST Top Entry Thru-Hole BergStik® Automotive Bulk; Manufacturer: Amphenol ICC; Supplier 1: Allied Electronics; Manufacturer Part Number: 68000-103HLF; RoHS: Yes; Category: Headers and Wire Housings; RoHS Compliant: Yes; ComponentLink1URL: http://www.farnell.com/cad/1914865.pdf?src-supplier=Farnell; ComponentLink1Description: http://www.farnell.com/cad/1914865.pdf?src-supplier=Farnell; ComponentLink2URL: http://www.farnell.com/cad/1914865.pdf?src-supplier=Element14; ComponentLink2Description: http://www.farnell.com/cad/1914865.pdf?src-supplier=Element14; ComponentLink3URL: http://www.farnell.com/cad/1914865.pdf?src-supplier=Newark; ComponentLink3Description: http://www.farnell.com/cad/1914865.pdf?src-supplier=Newark; ComponentLink4URL: https://cdn.amphenol-icc.com/media/wysiwyg/files/drawing/68000.pdf?src-supplier=Digi-Key; ComponentLink4Description: https://cdn.amphenol-icc.com/media/wysiwyg/files/drawing/68000.pdf?src-supplier=Digi-Key; Supplier Part Number 1: 70236888
L1 = L1210R2R2MDWIT: Inductor RF Chip Wirewound 2.2uH 20% 100KHz 1.13A 0.104Ohm DCR 1210 T/R; Manufacturer: KEMET; Core Material: Ferrite; Max DC Current: 2A; Shielding: Unshielded; Self Resonant Frequency: 190MHz; DC Resistance (DCR): 80mR; Supplier 1: Digi-Key; Manufacturer Part Number: L1210R2R2MDWIT; RoHS: Yes; Category: Fixed Inductors; Stock 1: 11928; Pricing 1: 1=0.50000, 10=0.43700, 25=0.40600, 50=0.34360, 100=0.31240, 250=0.29364, 500=0.26240 (USD); Mount: Surface Mount; Case/Package: 1210; Case Code (Metric): 3225; Case Code (Imperial): 1210; Min Operating Temperature: -40°C; Max Operating Temperature: 105°C; Tolerance: 20%; Inductance: 2.2uH; Package Quantity: 1000; Current Rating: 2A; Packaging: Tape and Reel; Inductance Tolerance: 20%; Resistor Type: Wirewound,Ceramic; Test Frequency: 100kHz; Termination: SMD/SMT; DC Current: 1.13A; Series: L-DWI; Length: 0.126inch; Width: 0.098inch; Height: 2.5mm; Height - Seated (Max): 0.106inch; Depth: 2.7mm; Radiation Hardening: No; REACH SVHC: No SVHC; Military Standard: Not; RoHS Compliant: Yes; ComponentLink1URL: https://datasheet.ciiva.com/4957/f3115-4957838.pdf?src-supplier=Mouser; ComponentLink1Description: https://datasheet.ciiva.com/4957/f3115-4957838.pdf?src-supplier=Mouser; ComponentLink2URL: https://datasheet.ciiva.com/6691/f3115-6691487.pdf?src-supplier=Digi-Key; ComponentLink2Description: https://datasheet.ciiva.com/6691/f3115-6691487.pdf?src-supplier=Digi-Key; ComponentLink3URL: https://datasheet.ciiva.com/8512/f3115-8512543.pdf?src-supplier=Avnet; ComponentLink3Description: https://datasheet.ciiva.com/8512/f3115-8512543.pdf?src-supplier=Avnet; ComponentLink4URL: https://datasheet.ciiva.com/17280/f3115-17280270.pdf?src-supplier=Avnet+Europe; ComponentLink4Description: https://datasheet.ciiva.com/17280/f3115-17280270.pdf?src-supplier=Avnet+Europe; ComponentLink5URL: https://datasheet.ciiva.com/22685/27262-22685038.pdf?src-supplier=Element14; ComponentLink5Description: https://datasheet.ciiva.com/22685/27262-22685038.pdf?src-supplier=Element14; Supplier Part Number 1: 399-9598-1-ND
MH1-MH3 = Mounting_hole_17.4_3.2: Mounting Hole plated
R1 R10 R11 = RC0805JR-074K7L: Res Thick Film 0805 4.7K Ohm 5% 0.125W(1/8W) ±100ppm/C Pad SMD T/R; Manufacturer: Yageo; Resistance: 4.7kR; Temperature Coefficient: 100ppm/°C; Power Rating: 125mW; Voltage Rating: 150V; Supplier 1: RSComponents; Manufacturer Part Number: RC0805JR-074K7L; RoHS: Yes; Category: Chip SMD Resistors; Stock 1: 17500; Pricing 1: 100=0.01400, 1000=0.01300, 2500=0.01200, 5000=0.01100, 10000=0.01000 (GBP); Case/Package: 0805; Contact Plating: Tin,Lead; Case Code (Imperial): 0805; Case Code (Metric): 2012; Size Code: 0805; Min Operating Temperature: -55°C; Max Operating Temperature: 155°C; Tolerance: 5%; Resistor Type: Thick Film; Packaging: Tape and Reel; Termination: SMD/SMT; Features: Moisture Resistant; Series: RC; Max Power Dissipation: 125mW; Number of Terminations: 2; Resistance Tolerance: 5%; Construction: Rectangular; Length: 2mm; Depth: 1.25mm; Radiation Hardening: No; Reach SVHC Compliant: Yes; Lead Free: Lead Free; Military Standard: Not; RoHS Compliant: Yes; ComponentLink1URL: https://datasheet.ciiva.com/12667/rc0805-12667037.pdf?src-supplier=Mouser; ComponentLink1Description: https://datasheet.ciiva.com/12667/rc0805-12667037.pdf?src-supplier=Mouser; ComponentLink2URL: https://datasheet.ciiva.com/7941/442941-7941974.pdf?src-supplier=Element14; ComponentLink2Description: https://datasheet.ciiva.com/7941/442941-7941974.pdf?src-supplier=Element14; ComponentLink3URL: https://datasheet.ciiva.com/7941/442941-7941973.pdf?src-supplier=Element14; ComponentLink3Description: https://datasheet.ciiva.com/7941/442941-7941973.pdf?src-supplier=Element14; ComponentLink4URL: https://datasheet.ciiva.com/17486/rc0805-17486827.pdf?src-supplier=Future+Electronics; ComponentLink4Description: https://datasheet.ciiva.com/17486/rc0805-17486827.pdf?src-supplier=Future+Electronics
R2 = RC0805FR-07100KL: Res Thick Film 0805 100K Ohm 1% 1/8W ±100ppm/°C Molded SMD Paper T/R; Manufacturer: Yageo; Resistance: 100kR; Power Rating: 125mW; Voltage Rating (DC): 150V; Supplier 1: RSComponents; Manufacturer Part Number: RC0805FR-07100KL; RoHS: Yes; Category: Chip SMD Resistors; Stock 1: 23600; Pricing 1: 5000=0.00400, 25000=0.00400, 50000=0.00400, 100000=0.00300, 200000=0.00300 (GBP); Case/Package: 0805; Number of Pins: 2; Case Code (Metric): 2012; Case Code (Imperial): 0805; Size Code: 0805; Min Operating Temperature: -55°C; Max Operating Temperature: 155°C; Resistor Type: Thick Film; Tolerance: 1%; Temperature Coefficient: 100ppm/°C; Packaging: Tape and Reel; Voltage Rating: 150V; Package Quantity: 1; Number of Terminations: 2; Termination: SMD/SMT; Max Power Dissipation: 125mW; Features: Moisture Resistant; Series: RC; Construction: Rectangular; Resistance Tolerance: 1%; Technology: THICK FILM; Length: 2mm; Width: 0.049inch; Height: 0.024inch; Depth: 1.25mm; Lead Pitch: 0.4mm; REACH SVHC: Unknown; Lead Free: Lead Free; RoHS Compliant: Yes; Military Standard: Not; ComponentLink1URL: https://datasheet.ciiva.com/11808/0900766b8106beab-11808858.pdf?src-supplier=RSComponents; ComponentLink1Description: https://datasheet.ciiva.com/11808/0900766b8106beab-11808858.pdf?src-supplier=RSComponents; ComponentLink2URL: https://datasheet.ciiva.com/7941/1686128-7941677.pdf?src-supplier=Element14; ComponentLink2Description: https://datasheet.ciiva.com/7941/1686128-7941677.pdf?src-supplier=Element14; ComponentLink3URL: https://datasheet.ciiva.com/7660/38627-7660796.pdf?src-supplier=Element14; ComponentLink3Description: https://datasheet.ciiva.com/7660/38627-7660796.pdf?src-supplier=Element14; ComponentLink4URL: https://datasheet.ciiva.com/22747/444164-22747534.pdf?src-supplier=Element14; ComponentLink4Description: https://datasheet.ciiva.com/22747/444164-22747534.pdf?src-supplier=Element14; ComponentLink5URL: https://datasheet.ciiva.com/2457/pyu-r-int-thick-7-2457018.pdf?src-supplier=Digi-Key; ComponentLink5Description: https://datasheet.ciiva.com/2457/pyu-r-int-thick-7-2457018.pdf?src-supplier=Digi-Key; ComponentLink6URL: https://datasheet.ciiva.com/2457/pyu-r-int-thick-7-2457019.pdf?src-supplier=Digi-Key; ComponentLink6Description: https://datasheet.ciiva.com/2457/pyu-r-int-thick-7-2457019.pdf?src-supplier=Digi-Key; ComponentLink7URL: https://datasheet.ciiva.com/2457/pyu-r-int-thick-7-2457017.pdf?src-supplier=Digi-Key; ComponentLink7Description: https://datasheet.ciiva.com/2457/pyu-r-int-thick-7-2457017.pdf?src-supplier=Digi-Key; ComponentLink8URL: https://datasheet.ciiva.com/12667/rc0805-12667001.pdf?src-supplier=Mouser; ComponentLink8Description: https://datasheet.ciiva.com/12667/rc0805-12667001.pdf?src-supplier=Mouser; ComponentLink9URL: https://datasheet.ciiva.com/7941/1697719-7941676.pdf?src-supplier=Element14; ComponentLink9Description: https://datasheet.ciiva.com/7941/1697719-7941676.pdf?src-supplier=Element14; ComponentLink10URL: https://datasheet.ciiva.com/7941/1697719-7941678.pdf?src-supplier=Element14; ComponentLink10Description: https://datasheet.ciiva.com/7941/1697719-7941678.pdf?src-supplier=Element14; ComponentLink11URL: https://datasheet.ciiva.com/16747/rc0805-16747226.pdf?src-supplier=Future+Electronics; ComponentLink11Description: https://datasheet.ciiva.com/16747/rc0805-16747226.pdf?src-supplier=Future+Electronics; Supplier Part Number 1: 1995648
R3 = RC0805FR-0722RL: Res SMD 0805 22R 1% 0.125W T.C.100PPM; Manufacturer: Yageo; Temperature Coefficient: 100ppm/°C; Power Rating: 125mW; Voltage Rating: 150V; Supplier 1: Digi-Key; Manufacturer Part Number: RC0805FR-0722RL; RoHS: Yes; Category: Chip SMD Resistors; Stock 1: 203007; Pricing 1: 1=0.10000, 10=0.04200, 100=0.01690, 1000=0.00759, 2500=0.00659 (USD); Case/Package: 0805; Case Code (Metric): 2012; Case Code (Imperial): 0805; Min Operating Temperature: -55°C; Max Operating Temperature: 155°C; Resistor Type: Thick Film; Resistance: 22R; Tolerance: 1%; Packaging: Tape and Reel; Package Quantity: 1; Number of Terminations: 2; Termination: SMD/SMT; Max Power Dissipation: 125mW; Working Voltage: 150V; Features: Moisture Resistant; Series: RC; Resistance Tolerance: 1%; Construction: Rectangular; Technology: THICK FILM; Length: 0.079inch; Width: 0.049inch; Height: 0.024inch; Depth: 1.25mm; REACH SVHC: Unknown; Lead Free: Lead Free; RoHS Compliant: Yes; Military Standard: Not; ComponentLink1URL: https://datasheet.ciiva.com/11819/0900766b8106beab-11819837.pdf?src-supplier=RSComponents; ComponentLink1Description: https://datasheet.ciiva.com/11819/0900766b8106beab-11819837.pdf?src-supplier=RSComponents; ComponentLink2URL: https://datasheet.ciiva.com/46447/444164-46447574.pdf?src-supplier=Element14; ComponentLink2Description: https://datasheet.ciiva.com/46447/444164-46447574.pdf?src-supplier=Element14; ComponentLink3URL: https://datasheet.ciiva.com/2457/pyu-r-int-thick-7-2457045.pdf?src-supplier=Digi-Key; ComponentLink3Description: https://datasheet.ciiva.com/2457/pyu-r-int-thick-7-2457045.pdf?src-supplier=Digi-Key; ComponentLink4URL: https://datasheet.ciiva.com/2457/pyu-r-int-thick-7-2457046.pdf?src-supplier=Digi-Key; ComponentLink4Description: https://datasheet.ciiva.com/2457/pyu-r-int-thick-7-2457046.pdf?src-supplier=Digi-Key; ComponentLink5URL: https://datasheet.ciiva.com/2457/pyu-r-int-thick-7-2457044.pdf?src-supplier=Digi-Key; ComponentLink5Description: https://datasheet.ciiva.com/2457/pyu-r-int-thick-7-2457044.pdf?src-supplier=Digi-Key; ComponentLink6URL: https://datasheet.ciiva.com/12667/rc0805-12667371.pdf?src-supplier=Mouser; ComponentLink6Description: https://datasheet.ciiva.com/12667/rc0805-12667371.pdf?src-supplier=Mouser; Supplier Part Number 1: 311-22.0CRCT-ND
R4-R6 R9 = RC0805FR-0710KL: Res SMD 0805 10K 1% 0.125W T.C.100PPM; Manufacturer: Yageo; Resistance: 10kR; Temperature Coefficient: 100ppm/°C; Power Rating: 125mW; Voltage Rating: 150V; Supplier 1: Digi-Key; Manufacturer Part Number: RC0805FR-0710KL; RoHS: Yes; Category: Chip SMD Resistors; Stock 1: 1849576; Pricing 1: 5000=0.00544 (USD); Case/Package: 0805; Case Code (Imperial): 0805; Case Code (Metric): 2012; Size Code: 0805; Min Operating Temperature: -55°C; Max Operating Temperature: 155°C; Tolerance: 1%; Resistor Type: Thick Film; Packaging: Tape and Reel; Package Quantity: 1; Termination: SMD/SMT; Number of Terminations: 2; Max Power Dissipation: 125mW; Features: Moisture Resistant; Series: RC; Construction: Rectangular; Resistance Tolerance: 1%; Technology: THICK FILM; Length: 2mm; Width: 0.049inch; Height: 0.024inch; Depth: 1.25mm; REACH SVHC: Unknown; Lead Free: Lead Free; Military Standard: Not; RoHS Compliant: Yes; Supplier Part Number 1: 311-10.0KCRTR-ND
R7 = RC0805FR-071ML: Res Thick Film 0805 1M Ohm 1% 0.125W(1/8W) ±100ppm/C Pad SMD T/R; Manufacturer: Yageo Phycomp; Temperature Coefficient: 100ppm/°C; Power Rating: 125mW; Resistance: 1MR; Voltage Rating (DC): 150V; Supplier 1: Digi-Key; Manufacturer Part Number: RC0805FR-071ML; RoHS: Yes; Category: Chip SMD Resistors; Stock 1: 541444; Pricing 1: 1=0.10000, 10=0.04200, 100=0.01690, 1000=0.00759, 2500=0.00659 (USD); Mount: Surface Mount; Case/Package: 0805; Number of Pins: 2; Min Operating Temperature: -55°C; Max Operating Temperature: 155°C; Tolerance: 1%; Packaging: Cut Tape; Length: 2mm; Width: 1.25mm; Height: 0.5mm; Depth: 1.25mm; REACH SVHC: No SVHC; Lead Free: Lead Free; ComponentLink1URL: http://www.farnell.com/datasheets/2167052.pdf?src-supplier=Farnell; ComponentLink1Description: http://www.farnell.com/datasheets/2167052.pdf?src-supplier=Farnell; ComponentLink2URL: http://www.mouser.com/ds/2/447/Yageo_08112016_RC0805-968729.pdf?src-supplier=Mouser; ComponentLink2Description: http://www.mouser.com/ds/2/447/Yageo_08112016_RC0805-968729.pdf?src-supplier=Mouser; ComponentLink3URL: http://www.farnell.com/datasheets/444164.pdf?src-supplier=Element14; ComponentLink3Description: http://www.farnell.com/datasheets/444164.pdf?src-supplier=Element14; ComponentLink4URL: http://www.farnell.com/datasheets/2167052.pdf?src-supplier=Newark; ComponentLink4Description: http://www.farnell.com/datasheets/2167052.pdf?src-supplier=Newark; ComponentLink5URL: http://www.yageo.com/documents/recent/PYu-RC_Group_51_RoHS_L_10.pdf?src-supplier=Digi-Key; ComponentLink5Description: http://www.yageo.com/documents/recent/PYu-RC_Group_51_RoHS_L_10.pdf?src-supplier=Digi-Key; Supplier Part Number 1: 311-1.00MCRCT-ND
R8 = RC0805JR-070RL: RC Series 0805 0.125 W 0 Ohm Jumper Surface Mount Thick Film Chip Resistor; Manufacturer: Yageo; Resistance: 0mR; Tolerance: 5%; Power Rating: 125mW; Voltage Rating: 150V; Temperature Coefficient: 200ppm/°C; Supplier 1: Digi-Key; Manufacturer Part Number: RC0805JR-070RL; RoHS: Yes; Category: Chip SMD Resistors; Stock 1: 3244701; Pricing 1: 1=0.10000, 10=0.03100, 25=0.02240, 50=0.01720, 100=0.01260, 250=0.00964, 500=0.00770, 1000=0.00567 (USD); Case/Package: 0805; Number of Pins: 2; Contact Plating: Tin,Matte; Case Code (Imperial): 0805; Case Code (Metric): 2012; Size Code: 0805; Min Operating Temperature: -55°C; Max Operating Temperature: 155°C; Resistor Type: Thick Film; Packaging: Tape and Reel; Voltage Rating (DC): 150V; Termination: SMD/SMT; Features: Moisture Resistant; Series: RC; Max Power Dissipation: 125mW; Number of Terminations: 2; Construction: Rectangular; Technology: THICK FILM; Resistance Tolerance: 5%; Length: 2mm; Width: 1.25mm; Height: 0.5mm; Depth: 1.25mm; Radiation Hardening: No; RoHS Compliant: Yes; REACH SVHC: Unknown; Military Standard: Not; Lead Free: Lead Free; ComponentLink1URL: https://datasheet.ciiva.com/7941/1738694-7941861.pdf?src-supplier=Element14; ComponentLink1Description: https://datasheet.ciiva.com/7941/1738694-7941861.pdf?src-supplier=Element14; ComponentLink2URL: https://datasheet.ciiva.com/11819/0900766b8106beab-11819430.pdf?src-supplier=RSComponents; ComponentLink2Description: https://datasheet.ciiva.com/11819/0900766b8106beab-11819430.pdf?src-supplier=RSComponents; ComponentLink3URL: https://datasheet.ciiva.com/7941/1738694-7941862.pdf?src-supplier=Element14; ComponentLink3Description: https://datasheet.ciiva.com/7941/1738694-7941862.pdf?src-supplier=Element14; ComponentLink4URL: https://datasheet.ciiva.com/7941/1738694-7941863.pdf?src-supplier=Element14; ComponentLink4Description: https://datasheet.ciiva.com/7941/1738694-7941863.pdf?src-supplier=Element14; ComponentLink5URL: https://datasheet.ciiva.com/15190/getdatasheetpartid-330685-15190028.pdf?src-supplier=Verical; ComponentLink5Description: https://datasheet.ciiva.com/15190/getdatasheetpartid-330685-15190028.pdf?src-supplier=Verical; Supplier Part Number 1: 311-0.0ARCT-ND
T1 = 2N7002: Transistor Mosfet N-ch 60V 0.3A 3-PIN SOT-23 T/r
U1 = ATMEGA328PB-AU: IC MCU 8BIT 32KB FLASH 32TQFP; Manufacturer: Microchip; Manufacturer Part Number: ATMEGA328PB-AU; RoHS: Yes; Category: Microcontrollers; Pricing 1: 1=1.72000, 10=1.72000, 50=1.58000, 100=1.58000, 1000=1.57000, 10000=1.57000 (USD); Case/Package: TQFP; RoHS Compliant: Yes; ComponentLink1URL: http://www.farnell.com/datasheets/2915218.pdf?src-supplier=Farnell; ComponentLink1Description: http://www.farnell.com/datasheets/2915218.pdf?src-supplier=Farnell; ComponentLink2URL: http://www.farnell.com/datasheets/2915218.pdf?src-supplier=Newark; ComponentLink2Description: http://www.farnell.com/datasheets/2915218.pdf?src-supplier=Newark; ComponentLink3URL: http://www.microchip.com/mymicrochip/filehandler.aspx?ddocname=en589666&src-supplier=Digi-Key; ComponentLink3Description: http://www.microchip.com/mymicrochip/filehandler.aspx?ddocname=en589666&src-supplier=Digi-Key; Supplier 1: Mouser; Supplier Part Number 1: 556-ATMEGA328PB-AU
U2 = AMS1117-3.3: Fixed Positive LDO Regulator, 3.3V, 1.3V Dropout, PDSO3; Manufacturer: Advanced Monolithic Systems; Manufacturer Part Number: AMS1117-3.3; RoHS: Yes; Category: Voltage Regulators - Linear; Stock 1: 212905; Pricing 1: 5=0.16010, 50=0.12830, 150=0.11280, 500=0.09900, 2500=0.09520, 5000=0.09290 (USD); RoHS Compliant: Yes; Supplier 1: LCSC; Supplier Part Number 1: C6186
Y1 = ABLS-16.000MHZ-B4-T: Crystal 16MHz ±30ppm (Tol) ±50ppm (Stability) 18pF FUND 40Ohm 2-Pin HC-49/US SMD T/R; Manufacturer: Abracon; ESR (Equivalent Series Resistance): 40R; Supplier 1: RSComponents; Manufacturer Part Number: ABLS-16.000MHZ-B4-T; RoHS: Yes; Category: Crystals; Stock 1: 450; Pricing 1: 25=0.22500, 75=0.21100, 150=0.18600, 300=0.18300, 600=0.17600 (GBP); Mount: Surface Mount; Case/Package: SMD/SMT; Min Operating Temperature: -20°C; Max Operating Temperature: 70°C; Package Quantity: 1000; Frequency: 16MHz; Frequency Tolerance: 30ppm; Load Capacitance: 18pF; Packaging: Tape and Reel; Tolerance: 30ppm; Frequency Stability: 50ppm; Termination: SMD/SMT; Series Resistance: 40R; Series: ABLS; Operating Frequency: 16 MHz; Length: 11.4mm; Width: 0.185inch; Height: 0.165inch; Depth: 4.7mm; Radiation Hardening: No; Reach SVHC Compliant: Yes; Lead Free: Lead Free; ComponentLink1URL: https://datasheet.ciiva.com/15116/getdatasheetpartid-719935-15116811.pdf?src-supplier=Verical; ComponentLink1Description: https://datasheet.ciiva.com/15116/getdatasheetpartid-719935-15116811.pdf?src-supplier=Verical; ComponentLink2URL: https://datasheet.ciiva.com/854/abls-854145.pdf?src-supplier=Digi-Key; ComponentLink2Description: https://datasheet.ciiva.com/854/abls-854145.pdf?src-supplier=Digi-Key; ComponentLink3URL: https://datasheet.ciiva.com/854/abls-854144.pdf?src-supplier=Digi-Key; ComponentLink3Description: https://datasheet.ciiva.com/854/abls-854144.pdf?src-supplier=Digi-Key; ComponentLink4URL: https://datasheet.ciiva.com/854/abls-854146.pdf?src-supplier=Digi-Key; ComponentLink4Description: https://datasheet.ciiva.com/854/abls-854146.pdf?src-supplier=Digi-Key; ComponentLink5URL: https://datasheet.ciiva.com/3175/abls-3175359.pdf?src-supplier=Avnet; ComponentLink5Description: https://datasheet.ciiva.com/3175/abls-3175359.pdf?src-supplier=Avnet; ComponentLink6URL: https://datasheet.ciiva.com/16423/abls-16423759.pdf?src-supplier=Future+Electronics; ComponentLink6Description: https://datasheet.ciiva.com/16423/abls-16423759.pdf?src-supplier=Future+Electronics; Supplier Part Number 1: 1710560